# Altium schematic sheet opamps.SchDoc
size A4
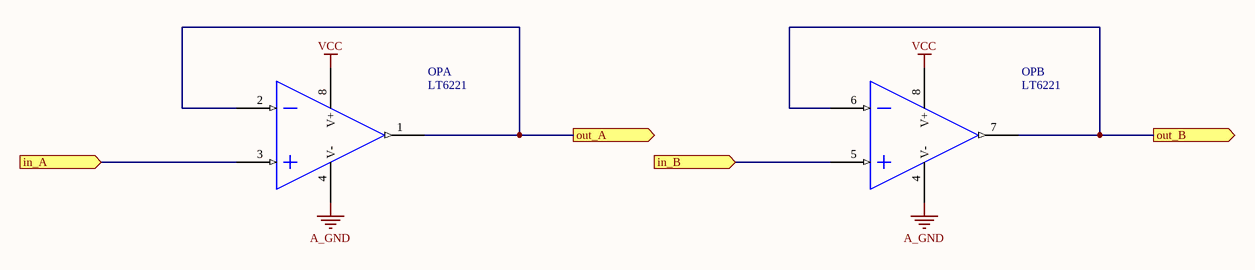
[diagram p0: opamps.SchDoc]

## Parts
OP  LT6221  (parts A,B of 2)

## Ports
in_A (in), in_B (in), out_A (out), out_B (out)

## Nets
A_GND: OP.4(V-)
VCC: OP.8(V+)
in_A: OP.3(IN1(+)) ; port in_A
in_B: OP.5(IN2(+)) ; port in_B
out_A: OP.1(OUT1) OP.2(IN1(-)) ; port out_A
out_B: OP.6(IN2(-)) OP.7(OUT2) ; port out_B